# EAGLE design P1-Port-Reader (EAGLE 7.3.0)
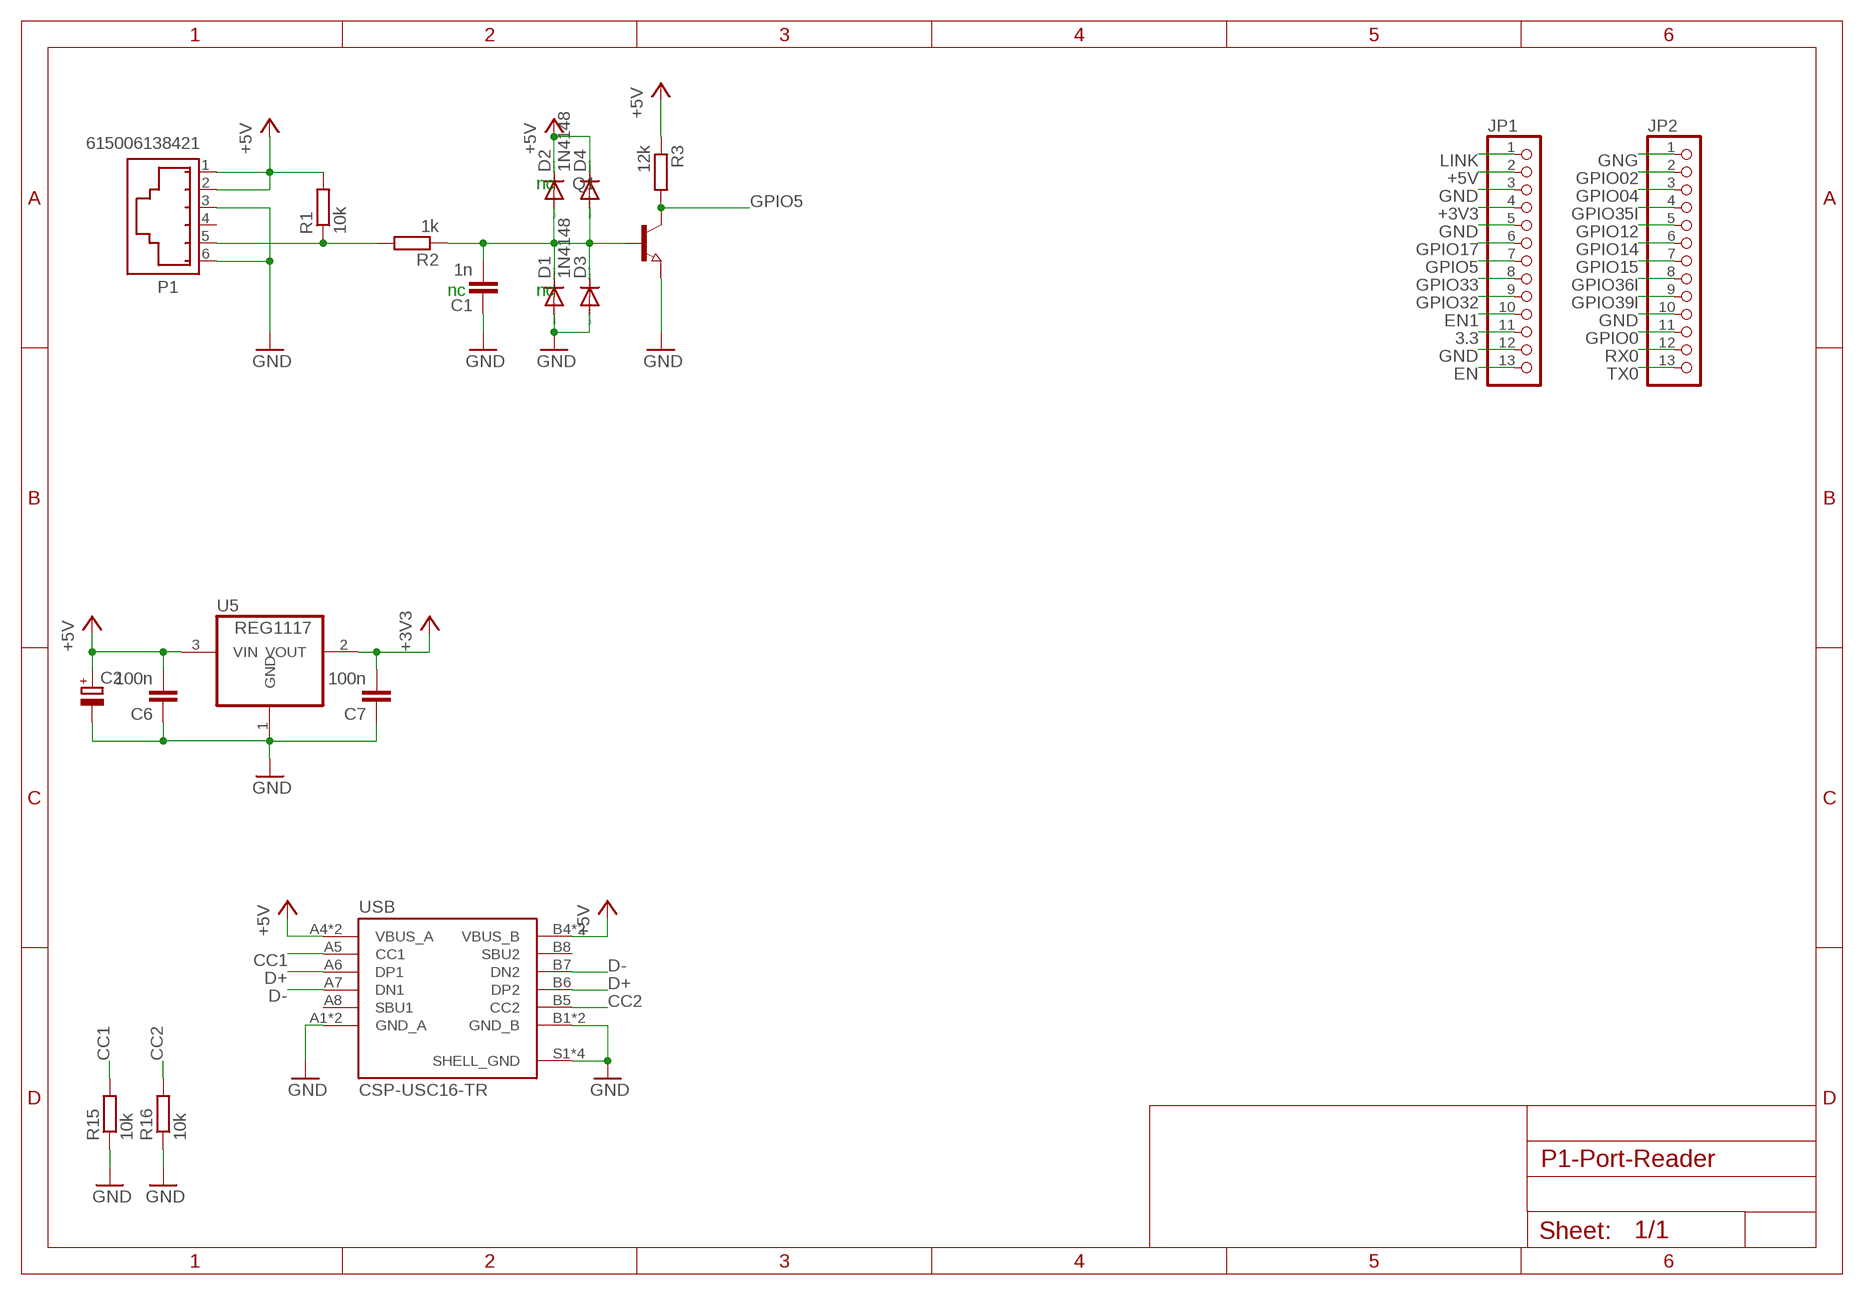
[diagram p0: schematic, sheet 1]

## Parts
C1  1n  C-EUC0805  [C0805]
C2  CPOL-EUE5-8.5  [E5-8,5]
C6  100n  C-EUC0805  [C0805]
C7  100n  C-EUC0805  [C0805]
D1  1N4148  DIODE-SOD123  [SOD123]
D2  1N4148  DIODE-SOD123  [SOD123]
D3  DIODE-SOD323-W  [SOD323-W]
D4  DIODE-SOD323-W  [SOD323-W]
JP1  PINHD-1X13  [1X13]
JP2  PINHD-1X13  [1X13]
P1  615006138421  [615006138421]
Q1  NPN-TRANSISTOR_SOT23  [SOT23]
R1  10k  R-EU_R0805  [R0805]
R2  1k  R-EU_R0805  [R0805]
R3  12k  R-EU_R0805  [R0805]
R15  10k  R-EU_R0603  [R0603]
R16  10k  R-EU_R0603  [R0603]
U5  REG1117  [SOT223]
USB  CSP-USC16-TR  [VALCON_CSP-USC16-TR]

## Nets
3.3: JP1.11
+3V3: C7.2 JP1.4 U5.2(VOUT)
+5V: C2.+ C6.2 D2.C D4.C JP1.2 P1.1 P1.2 R1.2 R3.1 U5.3(VIN) USB.A4(VBUS_A) USB.A9(VBUS_A) USB.B4(VBUS_B) USB.B9(VBUS_B)
CC1: R15.2 USB.A5(CC1)
CC2: R16.2 USB.B5(CC2)
D+: USB.A6(DP1) USB.B6(DP2)
D-: USB.A7(DN1) USB.B7(DN2)
EN: JP1.13
EN1: JP1.10
GND: C1.1 C2.- C6.1 C7.1 D1.A D3.A JP1.3 JP1.5 JP1.12 JP2.10 P1.3 P1.6 Q1.2(E) R15.1 R16.1 U5.1(GND) USB.A1(GND_A) USB.A12(GND_A) USB.B1(GND_B) USB.B12(GND_B) USB.S1(SHELL_GND) USB.S2(SHELL_GND) USB.S3(SHELL_GND) USB.S4(SHELL_GND)
GNG: JP2.1
GPIO0: JP2.11
GPIO02: JP2.2
GPIO04: JP2.3
GPIO5: JP1.7 Q1.3(C) R3.2
GPIO12: JP2.5
GPIO14: JP2.6
GPIO15: JP2.7
GPIO17: JP1.6
GPIO32: JP1.9
GPIO33: JP1.8
GPIO35I: JP2.4
GPIO36I: JP2.8
GPIO39I: JP2.9
LINK: JP1.1
N$3: P1.5 R1.1 R2.2
N$4: C1.2 D1.C D2.A D3.C D4.A Q1.1(B) R2.1
RX0: JP2.12
TX0: JP2.13
Unconnected: P1.4 USB.A8(SBU1) USB.B8(SBU2)

## Notes on the sheet
- nc
- nc | nc

## Library data of the parts
C1 C6 C7 = rcl:C-EU: CAPACITOR, European symbol
C2 = rcl:CPOL-EU: POLARIZED CAPACITOR, European symbol
D1-D4 = diode:DIODE-: DIODE
JP1 JP2 = pinhead:PINHD-1X13: PIN HEADER
P1 = Eagle_WR-MJ (rev22a):615006138421: WR-MJ Modular Jack Horizontal Plastic 6PxC Tab Up KIND PROPERTIES Quality Class:500 Mating cycles General Information Operating Temperature:-40 up to +85 °C Compliance: RoHS Electrical Properties IR 1:1.5A Working Voltage:120V (AC) Withstanding Voltage:1000V (AC) Contact Resistance:20mΩ RISO:500 MΩ Material Properties Insulator MateriaL:PBT Insulator Flammability Rating:UL94 V-0 Color:Black Contact Material Copper Alloy Contact Plating:Gold Contact Type:Stamped Packaging Properties Packaging:Tray <https://www.we-online.com/catalog/media/o33138v209%20Family_WR-MJ_61500x138421.jpg> Details see: https://www.we-online.com/catalog/en/MJ_HORIZONTAL_PLASTIC_6PXC_TAB_UP/? Updated by Yingchun,Shan 2020-01-06 2020 (C) Würth Elektronik; DATASHEET-URL: https://www.we-online.com/redexpert/spec/615006138421?ae; MOUNT: THT; PART-NUMBER: 615006138421; TYPE: Horizontal; XPXC: 6P6C
Q1 = semicon-smd-ipc:NPN-TRANSISTOR_: NPN TRANSISTOR
R1-R3 R15 R16 = rcl:R-EU_: RESISTOR, European symbol
U5 = burr-brown:REG1117: 800mA and 1A Low Dropout (LDO) Positive Regulator 1.8V, 2.5V, 2.85V, 3.3V, 5V, and Adj; MPN: REG1117; OC_FARNELL: 1097566; OC_NEWARK: 14P6981
USB = CSP-USC16-TR:CSP-USC16-TR: Check availability <https://pricing.snapeda.com/parts/CSP-USC16-TR/Valcon/view-part?ref=eda>; AVAILABILITY: In Stock; DESCRIPTION: CSP-USC16-TR Valcon USB Type C Surface Mount PCB Socket; MF: Valcon; MP: CSP-USC16-TR; PACKAGE: None; PRICE: None; PURCHASE-URL: https://pricing.snapeda.com/search/part/CSP-USC16-TR/?ref=eda

## Net classes
0 default: clearance 0.205 mm

## Board
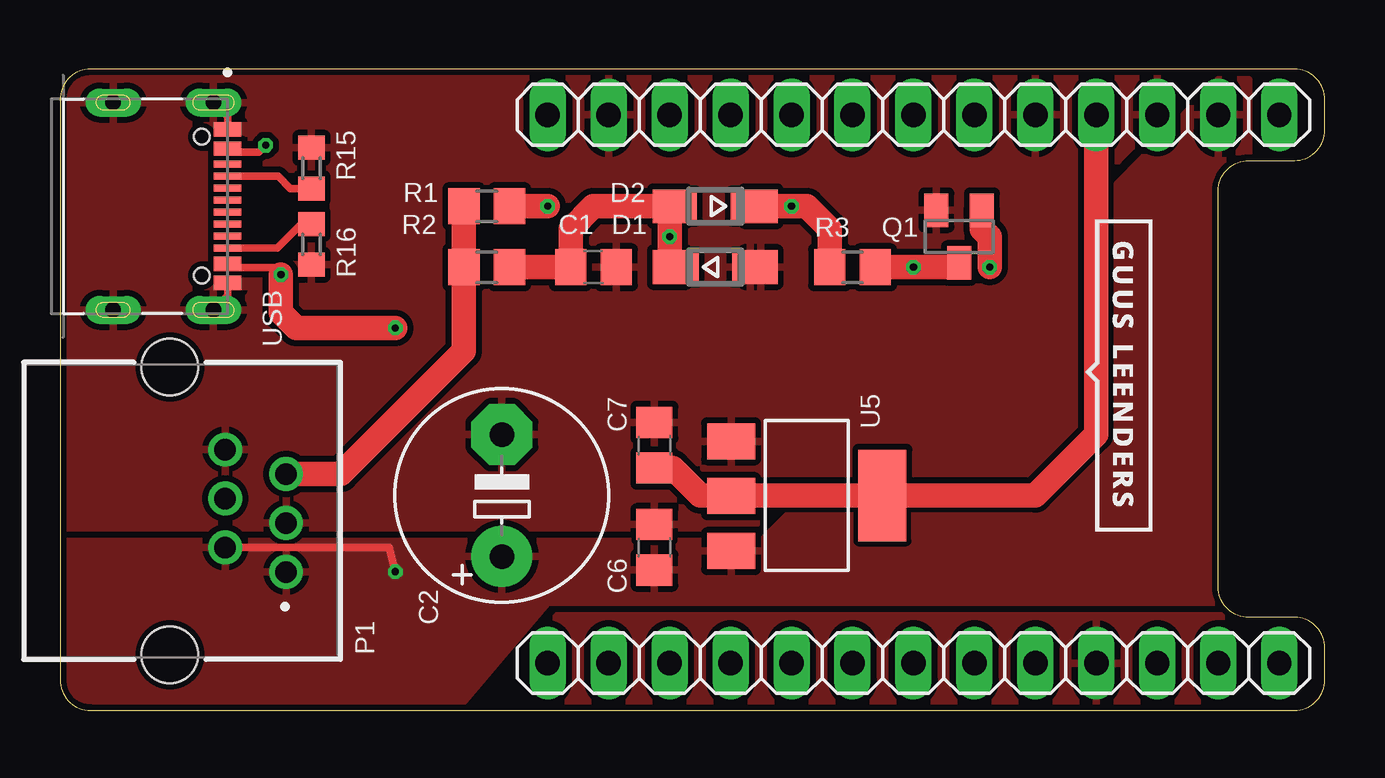
[diagram p1: board, top side]
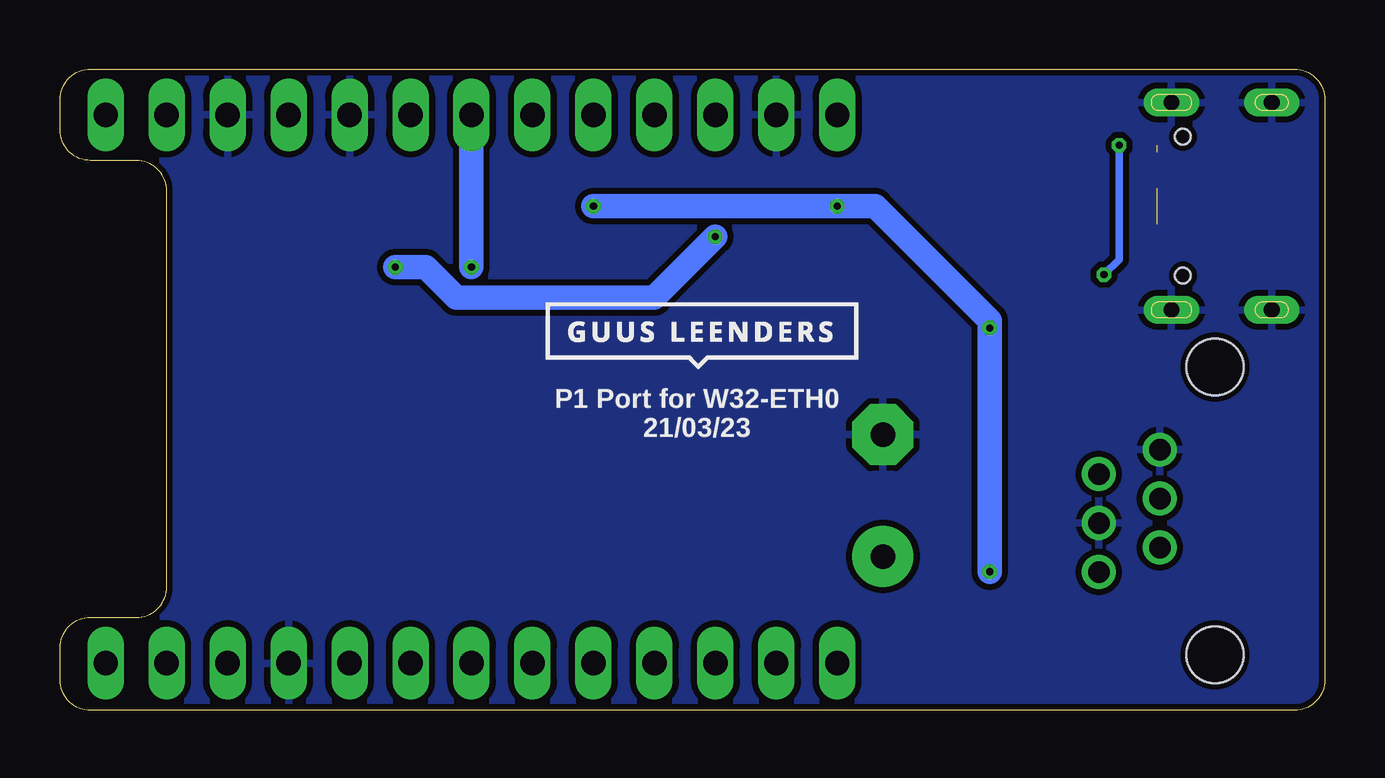
[diagram p2: board, bottom side, seen from below]

Size 52.7 x 26.73 mm. Coordinates in mm from the lower left corner, seen from the top.
Outline: 51.44,0 arc90 52.7,1.27 52.7,2.6 arc90 51.44,3.87 49.53,3.87 arc-90 48.26,5.14 48.26,21.65 arc-90 49.53,22.92 51.44,22.92 arc90 52.7,24.19 52.7,25.46 arc90 51.44,26.73 1.27,26.73 arc90 0,25.46 0,1.27 arc90 1.27,0 51.44,0
Copper layers (1*16): Top 0.035mm / dielectric 1.5mm / Bottom 0.035mm
Design rules "seeed-studio-2-layer": minimum track width 6mil, minimum drill 12mil, track to track 6mil, track to pad 6mil, pad to pad 6mil, via to via 6mil, smd to smd 0mil, copper to edge 10mil, drill to drill 10mil, minimum pad ring 10mil, minimum via ring 6mil, stop-mask expansion 2mil, vias tented up to drill 100mil, thermal gap 10mil

### Footprints (pad centres in the part's own frame; a part is rotated, then mirrored left to right if it is on the bottom)
C0805 = smd 1.3 x 1.5: 1 -0.95,0; 2 0.95,0
E5-8,5 = drill 1.016 pad 2.54: + -2.54,0 | drill 1.016 pad 2.54 octagon: - 2.54,0
SOD123 = smd 1.4 x 1.4: A 1.9,0; C -1.9,0
SOD323-W = smd 1.5 x 1.2: A 1.45,0; C -1.45,0
1X13 = drill 1.016 long: 1 -15.24,0; 2 -12.7,0; 3 -10.16,0; 4 -7.62,0; 5 -5.08,0; 6 -2.54,0; 7 0,0; 8 2.54,0; 9 5.08,0; 10 7.62,0; 11 10.16,0; 12 12.7,0; 13 15.24,0
615006138421 = drill 0.9: 1 2.55,4.34; 2 1.53,1.8; 3 0.51,4.34; 4 -0.51,1.8; 5 -1.53,4.34; 6 -2.55,1.8 | hole 2.36: -6,-0.5; 6,-0.5
SOT23 = smd 1 x 1.4: 1 -0.95,-1.1; 2 0.95,-1.1; 3 0,1.1
R0805 = smd 1.3 x 1.5: 1 -0.95,0; 2 0.95,0
R0603 = smd 1 x 1.1: 1 -0.85,0; 2 0.85,0
SOT223 = smd 1.499 x 2.007: 1 -2.261,-3.15; 2 0.025,-3.15; 3 2.311,-3.15 | smd 3.81 x 2.007: 4 0,3.15
VALCON_CSP-USC16-TR = smd 0.3 x 1.14: A1 -3.35,0; A4 -2.55,0; A5 -1.25,0; A6 -0.25,0; A7 0.25,0; A8 1.25,0; A9 2.55,0; A12 3.35,0; B1 3.05,0; B4 2.25,0; B5 1.75,0; B6 0.75,0; B7 -0.75,0; B8 -1.75,0; B9 -2.25,0; B12 -3.05,0 | drill 0.65 pad 1 long: S1 -4.325,-0.59; S2 4.325,-0.59 | drill 0.65 pad 0.9 long: S3 -4.325,-4.77; S4 4.325,-4.77 | hole 0.65: -2.89,-1.07; 2.89,-1.07

### Placement (x,y rotation side)
C1  22.23,18.48 180 top
C2  18.41,8.95 90 top
C6  24.77,6.79 270 top
C7  24.77,11.05 270 top
D1  27.3,18.48 0 top
D2  27.3,21.02 180 top
D3  27.3,18.48 0 top
D4  27.24,21.02 180 top
JP1  35.56,24.83 180 top
JP2  35.56,1.97 0 top
P1  5.08,8.32 270 top
Q1  37.47,19.75 180 top
R1  17.78,21.02 0 top
R2  17.78,18.48 180 top
R3  33.02,18.48 0 top
R15  10.48,22.61 270 top
R16  10.48,19.43 90 top
U5  31.11,8.95 270 top
USB  6.98,21.02 270 top

### Tracks (layer width: path | path; a pad name or v marks a point on that pad's centre or on a via)
+3V3
  Top 1.016: C7.2 25.52,10.1 26.67,8.95 27.94,8.95 U5.2 27.99,8.95 40.64,8.95 43.18,11.49 JP1.4
+5V  (via drill 0.3)  (1 unrouted)
  Top 0.305: P1.2 13.71,6.79 v13.97,5.78 | USB.B4 USB.A9 8.9,18.47 v9.21,18.16 | USB.B9 8.28,23.27 v8.57,23.56
  Top 1.016: R3.1 32.07,20.06 31.11,21.02 v30.48,21.02 D2.C D4.C | R1.2 v20.32,21.02 | v13.97,15.94 9.84,15.94 9.21,16.57 v9.21,18.16
  Bottom 0.305: v8.57,23.56 8.57,18.8 v9.21,18.16
  Bottom 1.016: v30.48,21.02 v20.32,21.02 R1.2 13.97,16.26 v13.97,15.94 v13.97,5.78
  pour Top: 0,7.05 0,0 16.51,0 20.32,4.51 49.53,4.51 49.53,26.29 48.26,26.29 43.18,21.02 43.18,10.86 40.64,8.32 30.48,8.32 29.21,7.05
CC1
  Top 0.305: USB.A5 9.08,22.27 9.6,21.76 R15.2
CC2
  Top 0.305: USB.B5 9.04,19.27 10.06,20.28 R16.2
D+  (1 unrouted)
D-  (1 unrouted)
GND
  Top 0.305: USB.A1 6.98,24.75 USB.S1 | USB.A12 6.98,17.28 USB.S2
  Top 1.016: D1.A
  pour Top (isolate 0.254, rank 6): -5.08,28.83 -5.08,-5.65 55.88,-5.65 55.88,28.64
  pour Bottom (isolate 0.254, rank 6): 55.88,28.64 55.88,-4.38 -5.08,-4.38 -5.08,29.91 55.88,29.91
GPIO5  (via drill 0.3)
  Top 1.016: R3.2 v35.56,18.48 36.83,18.48 37.3,18.48 Q1.3
  Bottom 1.016: JP1.7 v35.56,18.48
N$3
  Top 1.016: R1.1 R2.2 16.83,14.99 11.69,9.85 P1.5
N$4  (via drill 0.3)
  Top 1.016: R2.1 C1.2 21.27,20.07 22.23,21.02 D2.A | D2.A v25.41,19.75 D1.C D3.C | Q1.1 38.41,20.07 38.73,19.75 v38.73,18.48 | D4.A D2.A
  Bottom 1.016: v38.73,18.48 37.47,18.48 36.2,17.21 27.95,17.21 v25.41,19.75

### Text on the board
bNames: P1 Port for W32-ETH0 / 21/03/23